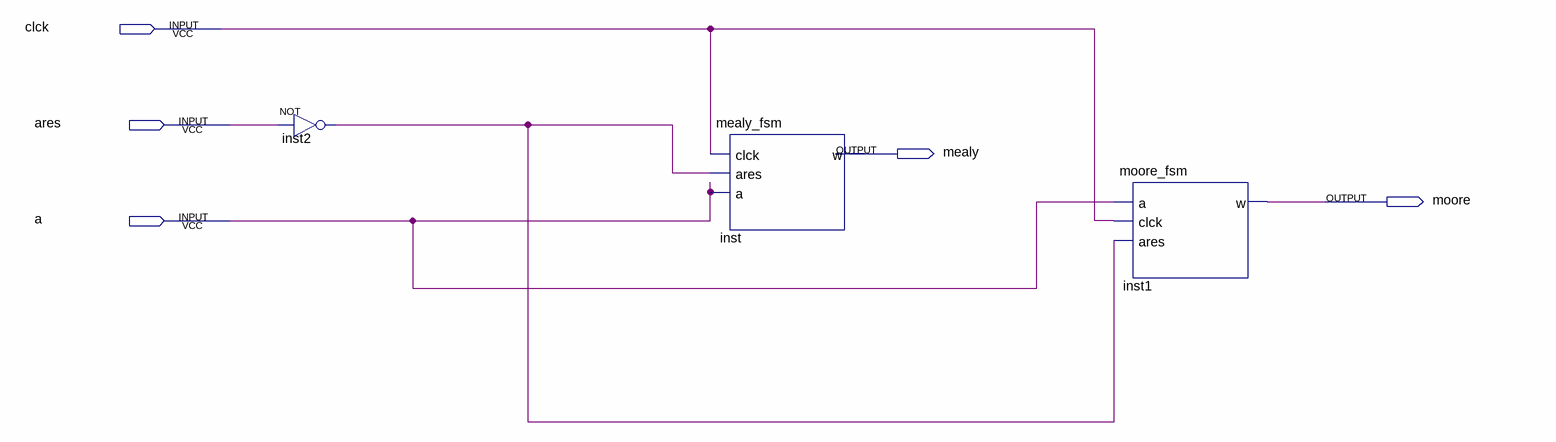
[diagram p0: schematic sheet]
// Quartus schematic baredavazdah.bdf as structural Verilog: 3 symbols, 5 pins
module baredavazdah (
  input  clck,
  input  ares,
  input  a,
  output mealy,
  output moore
);

  wire inst2_out;

  not inst2 (inst2_out, ares);
  mealy_fsm inst (.clck(clck), .ares(inst2_out), .a(a), .w(mealy));
  moore_fsm inst1 (.a(a), .clck(clck), .ares(inst2_out), .w(moore));
endmodule
